# Altium schematic sheet 02_BLBB_MCU.SchDoc
size A4; SheetNumber: 3; SheetTotal: 4
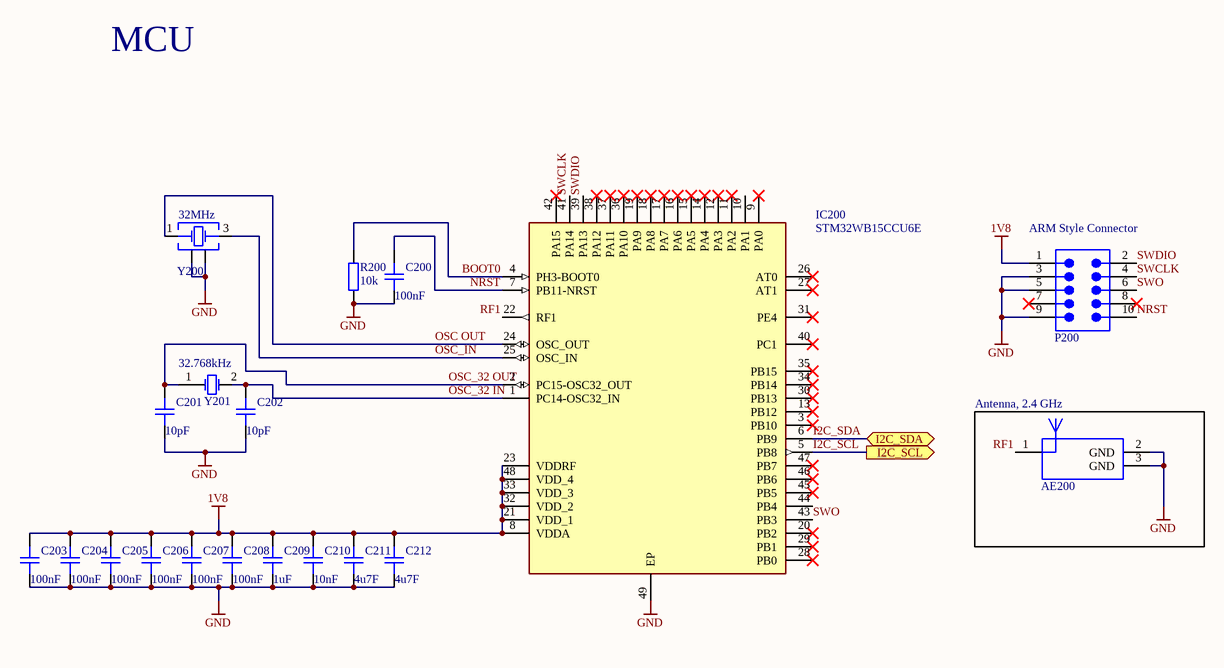
[diagram p0: 02_BLBB_MCU.SchDoc]

## Parts
AE200  7488960245  [7488960245]  (value not drawn)
C200  100nF  [CAP_0603]
C201  10pF  [CAP_0603]
C202  10pF  [CAP_0603]
C203  100nF  [CAP_0603]
C204  100nF  [CAP_0603]
C205  100nF  [CAP_0603]
C206  100nF  [CAP_0603]
C207  100nF  [CAP_0603]
C208  100nF  [CAP_0603]
C209  1uF  [CAP_0603]
C210  10nF  [CAP_0603]
C211  4u7F  [CAP_0603]
C212  4u7F  [CAP_0603]
IC200  STM32WB15CCU6E  [QFN50P700X700X65-49N-D]
P200  62701020621  [62701020621]  (value not drawn)
R200  10k  [RES_0603]
Y200  32MHz  [WE-XTAL_CFPX-180]
Y201  32.768kHz  [WE-XTAL_CFPX-217]

## Blocks framed on the sheet
Antenna, 2.4 GHz: AE200

## Ports
I2C_SCL (out), I2C_SDA (bidir)

## Nets
1V8: C203.2 C204.2 C205.2 C206.2 C207.2 C208.2 C209.2 C210.2 C211.2 C212.2 IC200.8(VDDA) IC200.21(VDD_1) IC200.23(VDDRF) IC200.32(VDD_2) IC200.33(VDD_3) IC200.48(VDD_4) P200.1
GND: AE200.2(GND) AE200.3(GND) C200.1 C201.1 C202.1 C203.1 C204.1 C205.1 C206.1 C207.1 C208.1 C209.1 C210.1 C211.1 C212.1 IC200.49(EP) P200.3 P200.5 P200.9 R200.1 Y200.2(GND&Lid) Y200.4(GND&Lid)
BOOT0: IC200.4(PH3-BOOT0) R200.2
I2C_SCL: IC200.5(PB8) ; port I2C_SCL
I2C_SDA: IC200.6(PB9) ; port I2C_SDA
NRST: C200.2 IC200.7(PB11-NRST) P200.10
OSC OUT: IC200.24(OSC_OUT) Y200.1(Crystal)
OSC_32 IN: C202.2 IC200.1(PC14-OSC32_IN) Y201.2(OSC2)
OSC_32 OUT: C201.2 IC200.2(PC15-OSC32_OUT) Y201.1(OSC1)
OSC_IN: IC200.25(OSC_IN) Y200.3(Crystal)
RF1: AE200.1(Feed) IC200.22(RF1)
SWCLK: IC200.41(PA14) P200.4
SWDIO: IC200.39(PA13) P200.2
SWO: IC200.43(PB3) P200.6

Not connected (* = marked no-connect by the designer): IC200 3(PB10)* 9(PA0)* 10(PA1) 11(PA2)* 12(PA3)* 13(PB12)* 14(PA4)* 15(PA5)* 16(PA6)* 17(PA7)* 18(PA8)* 19(PA9)* 20(PB2)* 26(AT0)* 27(AT1)* 28(PB0)* 29(PB1)* 30(PB13)* 31(PE4)* 34(PB14)* 35(PB15)* 36(PA10)* 37(PA11)* 38(PA12)* 40(PC1)* 42(PA15)* 44(PB4) 45(PB5)* 46(PB6)* 47(PB7)*; P200 7* 8*

## Notes on the sheet
- MCU
- (near P200) ARM Style Connector

## Library data of the parts
AE200 = 7488960245: WE-MCA SMT Multilayer Chip Antenna, 1 Band, 2400-2500MHz, 50Ω; Manufacturer: Wurth Elektronik; Number of Bands: 1; Peak Gain: 3dBi; VSWR: 2.5; ComponentLink1Description: Website Link; ComponentLink1URL: https://www.we-online.com/redexpert/article/7488960245?ad; ComponentLink2Description: Datasheet Link; ComponentLink2URL: https://www.we-online.com/redexpert/spec/7488960245?ad; Manufacturer Part Number: 7488960245; Category: Antennas; Match Code: WE-MCA; Mount: Surface Mount; Operating Temperature Max: 85°C; Operating Temperature Min: -40°C; Packaging: Tape and Reel; Length: 5.2mm; Width: 3.7mm; Height: 0.7mm; Frequency Range: 2400-2500MHz; Impedance: 50Ω
C200-C212 = CAP_0603_10V: Capacitor SMD 0603 10V
IC200 = STM32WB15CCU6E: Integrated Circuit; Manufacturer_Name: STMicroelectronics; Datasheet Link: https://www.st.com/resource/en/datasheet/stm32wb15cc.pdf; Height: 0.65mm; Manufacturer_Part_Number: STM32WB15CCU6E; Mouser Part Number: 511-STM32WB15CCU6E; Mouser Price/Stock: https://www.mouser.co.uk/ProductDetail/STMicroelectronics/STM32WB15CCU6E?qs=DRkmTr78QARFXKemW9838Q%3D%3D; Arrow Part Number: STM32WB15CCU6E; Arrow Price/Stock: https://www.arrow.com/en/products/stm32wb15ccu6e/stmicroelectronics?region=nac
P200 = 62701020621: WR-BHD Male Box Header, SMT Straight, pitch 1.27mm, 10pins; Manufacturer: Wurth Elektronik; Contact Resistance: 20mΩ; Insulation Resistance: 1000MΩ; Rated Current: 1A; Working Voltage: 50V; Withstanding Voltage: 500V; ComponentLink1Description: Website Link; ComponentLink1URL: https://www.we-online.com/redexpert/article/62701020621?ad; ComponentLink2Description: Datasheet Link; ComponentLink2URL: https://www.we-online.com/redexpert/spec/62701020621?ad; Manufacturer Part Number: 62701020621; Category: Wire-to-Board Connectors; Match Code: WR-BHD; Mount: Surface Mount; Operating Temperature Max: 105°C; Operating Temperature Min: -40°C; Packaging: Tape and Reel; Length: 12.7mm; Width: 5mm; Height: 5.3mm; Gender: Male; Number of Pins: 10; Number of Rows: 2; Orientation: Straight; Pitch: 1.27mm
R200 = RES_0603: Resistor SMD 0603
Y200 = 830060258: WE-XTAL Quartz Crystal, SMT, CFPX-180, 32MHz, +/-30ppm; Manufacturer: Wurth Elektronik; Load Capacitance: 10pF; ComponentLink1Description: Website Link; ComponentLink1URL: https://www.we-online.com/redexpert/article/830060258?ad; ComponentLink2Description: Datasheet Link; ComponentLink2URL: https://www.we-online.com/redexpert/spec/830060258?ad; Manufacturer Part Number: 830060258; Category: Crystals; Match Code: WE-XTAL; Mount: Surface Mount; Operating Temperature Max: 70°C; Operating Temperature Min: -20°C; Packaging: Tape and Reel; Case/Size Code: CFPX-180; Length: 3.4mm; Width: 2.7mm; Height: 0.8mm; Frequency: 32MHz; Frequency Stability: +/-30ppm; Frequency Tolerance: +/-30ppm
Y201 = 830009709: WE-XTAL Watch Crystal, SMT, CFPX-217, 32.768kHz, +/-20ppm; Manufacturer: Wurth Elektronik; Load Capacitance: 7pF; ComponentLink1Description: Website Link; ComponentLink1URL: https://www.we-online.com/redexpert/article/830009709?ad; ComponentLink2Description: Datasheet Link; ComponentLink2URL: https://www.we-online.com/redexpert/spec/830009709?ad; Manufacturer Part Number: 830009709; Category: Crystals; Match Code: WE-XTAL; Mount: Surface Mount; Operating Temperature Max: 85°C; Operating Temperature Min: -40°C; Packaging: Tape and Reel; Case/Size Code: CFPX-217; Length: 3.2mm; Width: 1.5mm; Height: 0.9mm; Frequency: 32.768kHz; Frequency Tolerance: +/-20ppm